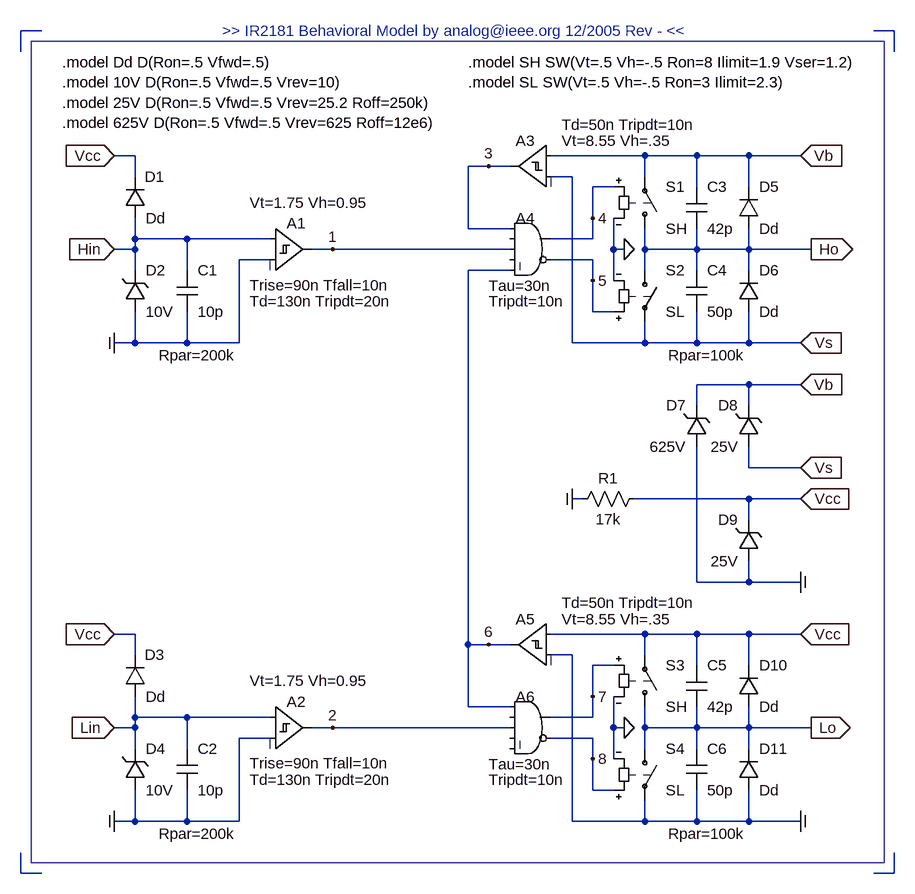
[diagram p0: schematic IR2181.asc]
IR2181.asc, the LTspice schematic file:
Version 4
SHEET 1 13828 1048
WIRE -496 -592 -496 -624
WIRE -496 672 -496 640
WIRE -464 -624 -496 -624
WIRE -464 672 -496 672
WIRE -320 -432 -352 -432
WIRE -320 -400 -320 -432
WIRE -320 -304 -320 -336
WIRE -320 -288 -352 -288
WIRE -320 -288 -320 -304
WIRE -320 -256 -320 -288
WIRE -320 -144 -352 -144
WIRE -320 -144 -320 -192
WIRE -320 304 -352 304
WIRE -320 336 -320 304
WIRE -320 432 -320 400
WIRE -320 448 -352 448
WIRE -320 448 -320 432
WIRE -320 480 -320 448
WIRE -320 592 -352 592
WIRE -320 592 -320 544
WIRE -240 -304 -320 -304
WIRE -240 -256 -240 -304
WIRE -240 -144 -320 -144
WIRE -240 -144 -240 -192
WIRE -240 432 -320 432
WIRE -240 480 -240 432
WIRE -240 592 -320 592
WIRE -240 592 -240 544
WIRE -160 -144 -240 -144
WIRE -160 -144 -160 -272
WIRE -160 592 -240 592
WIRE -160 592 -160 464
WIRE -112 -304 -240 -304
WIRE -112 -272 -160 -272
WIRE -112 432 -240 432
WIRE -112 464 -160 464
WIRE -16 -288 -48 -288
WIRE -16 448 -48 448
WIRE 192 -320 192 -416
WIRE 192 320 192 -256
WIRE 192 416 192 320
WIRE 224 -416 192 -416
WIRE 224 320 192 320
WIRE 256 -416 224 -416
WIRE 256 -320 192 -320
WIRE 256 -288 -16 -288
WIRE 256 -256 192 -256
WIRE 256 320 224 320
WIRE 256 416 192 416
WIRE 256 448 -16 448
WIRE 352 -400 320 -400
WIRE 352 -144 352 -400
WIRE 352 336 320 336
WIRE 352 592 352 336
WIRE 368 96 352 96
WIRE 384 -336 384 -384
WIRE 384 -304 320 -304
WIRE 384 -304 384 -336
WIRE 384 -272 320 -272
WIRE 384 -240 384 -272
WIRE 384 -192 384 -240
WIRE 384 400 384 352
WIRE 384 432 320 432
WIRE 384 432 384 400
WIRE 384 464 320 464
WIRE 384 496 384 464
WIRE 384 544 384 496
WIRE 416 -384 384 -384
WIRE 416 -288 416 -336
WIRE 416 -240 416 -288
WIRE 416 -192 384 -192
WIRE 416 352 384 352
WIRE 416 448 416 400
WIRE 416 496 416 448
WIRE 416 544 384 544
WIRE 432 -288 416 -288
WIRE 432 448 416 448
WIRE 464 -432 320 -432
WIRE 464 -400 464 -432
WIRE 464 -288 464 -320
WIRE 464 -256 464 -288
WIRE 464 -144 352 -144
WIRE 464 -144 464 -176
WIRE 464 304 320 304
WIRE 464 336 464 304
WIRE 464 448 464 416
WIRE 464 480 464 448
WIRE 464 592 352 592
WIRE 464 592 464 560
WIRE 544 -432 464 -432
WIRE 544 -384 544 -432
WIRE 544 -288 464 -288
WIRE 544 -288 544 -320
WIRE 544 -256 544 -288
WIRE 544 -144 464 -144
WIRE 544 -144 544 -192
WIRE 544 -48 544 -80
WIRE 544 224 544 16
WIRE 544 304 464 304
WIRE 544 352 544 304
WIRE 544 448 464 448
WIRE 544 448 544 416
WIRE 544 480 544 448
WIRE 544 592 464 592
WIRE 544 592 544 544
WIRE 624 -432 544 -432
WIRE 624 -384 624 -432
WIRE 624 -288 544 -288
WIRE 624 -288 624 -320
WIRE 624 -256 624 -288
WIRE 624 -144 544 -144
WIRE 624 -144 624 -192
WIRE 624 -80 544 -80
WIRE 624 -48 624 -80
WIRE 624 48 624 16
WIRE 624 96 448 96
WIRE 624 128 624 96
WIRE 624 224 544 224
WIRE 624 224 624 192
WIRE 624 304 544 304
WIRE 624 352 624 304
WIRE 624 448 544 448
WIRE 624 448 624 416
WIRE 624 480 624 448
WIRE 624 592 544 592
WIRE 624 592 624 544
WIRE 704 -432 624 -432
WIRE 704 -144 624 -144
WIRE 704 -80 624 -80
WIRE 704 48 624 48
WIRE 704 96 624 96
WIRE 704 224 624 224
WIRE 704 304 624 304
WIRE 704 592 624 592
WIRE 720 -288 624 -288
WIRE 720 448 624 448
WIRE 848 -624 816 -624
WIRE 848 -592 848 -624
WIRE 848 672 816 672
WIRE 848 672 848 640
FLAG 720 -288 Ho
IOPIN 720 -288 Out
FLAG -352 -288 Hin
IOPIN -352 -288 In
FLAG 704 -432 Vb
IOPIN 704 -432 In
FLAG 704 -144 Vs
IOPIN 704 -144 In
FLAG 704 224 Com
IOPIN 704 224 In
FLAG 704 304 Vcc
IOPIN 704 304 In
FLAG 704 592 Com
IOPIN 704 592 In
FLAG 720 448 Lo
IOPIN 720 448 Out
FLAG 432 -288 0
FLAG 224 320 6
FLAG 384 400 7
FLAG 384 496 8
FLAG -352 448 Lin
IOPIN -352 448 In
FLAG 704 96 Vcc
IOPIN 704 96 In
FLAG 704 -80 Vb
IOPIN 704 -80 In
FLAG 704 48 Vs
IOPIN 704 48 In
FLAG -16 448 2
FLAG 384 -336 4
FLAG 384 -240 5
FLAG -352 -432 Vcc
IOPIN -352 -432 In
FLAG -352 304 Vcc
IOPIN -352 304 In
FLAG -16 -288 1
FLAG 224 -416 3
FLAG -352 592 Com
IOPIN -352 592 In
FLAG -352 -144 Com
IOPIN -352 -144 In
FLAG 352 96 Com
IOPIN 352 96 In
FLAG 432 448 0
SYMBOL diode -336 -336 M180
WINDOW 0 31 64 Left 0
WINDOW 3 32 0 Left 0
SYMATTR InstName D1
SYMATTR Value Dd
SYMBOL zener -336 -192 M180
WINDOW 0 32 64 Left 0
WINDOW 3 32 0 Left 0
SYMATTR InstName D2
SYMATTR Value 10V
SYMBOL cap -256 -256 R0
WINDOW 0 32 0 Left 0
WINDOW 3 32 64 Left 0
WINDOW 39 32 131 Center 0
SYMATTR InstName C1
SYMATTR Value 10p
SYMATTR SpiceLine Rpar=200k
SYMBOL Digital\\diffschmtbuf -112 -352 R0
WINDOW 0 40 24 Center 0
WINDOW 3 -32 -8 Left 0
WINDOW 123 -32 119 Left 0
WINDOW 39 -32 144 Left 0
SYMATTR InstName A1
SYMATTR Value Vt=1.75 Vh=0.95
SYMATTR Value2 Trise=90n Tfall=10n
SYMATTR SpiceLine Td=130n Tripdt=20n
SYMBOL diode -336 400 M180
WINDOW 0 31 64 Left 0
WINDOW 3 32 0 Left 0
SYMATTR InstName D3
SYMATTR Value Dd
SYMBOL zener -336 544 M180
WINDOW 0 32 64 Left 0
WINDOW 3 32 0 Left 0
SYMATTR InstName D4
SYMATTR Value 10V
SYMBOL cap -256 480 R0
WINDOW 0 32 0 Left 0
WINDOW 3 32 64 Left 0
WINDOW 39 32 131 Center 0
SYMATTR InstName C2
SYMATTR Value 10p
SYMATTR SpiceLine Rpar=200k
SYMBOL Digital\\diffschmtbuf -112 384 R0
WINDOW 0 40 24 Center 0
WINDOW 3 -32 -8 Left 0
WINDOW 123 -32 119 Left 0
WINDOW 39 -32 144 Left 0
SYMATTR InstName A2
SYMATTR Value Vt=1.75 Vh=0.95
SYMATTR Value2 Trise=90n Tfall=10n
SYMATTR SpiceLine Td=130n Tripdt=20n
SYMBOL Digital\\diffschmtbuf 320 -480 M0
WINDOW 0 40 25 Center 0
WINDOW 3 -16 25 Right 0
WINDOW 123 -16 0 Right 0
SYMATTR InstName A3
SYMATTR Value Vt=8.55 Vh=.35
SYMATTR Value2 Td=50n Tripdt=10n
SYMBOL Digital\\and 288 -352 R0
WINDOW 0 -8 16 Center 0
WINDOW 3 -64 120 Left 0
WINDOW 123 -64 144 Left 0
SYMATTR InstName A4
SYMATTR Value Tau=30n
SYMATTR Value2 Tripdt=10n
SYMBOL sw 464 -304 M180
WINDOW 0 32 80 Left 0
WINDOW 3 32 16 Left 0
SYMATTR InstName S1
SYMATTR Value SH
SYMBOL sw 464 -272 R0
WINDOW 0 32 16 Left 0
WINDOW 3 32 80 Left 0
SYMATTR InstName S2
SYMATTR Value SL
SYMBOL cap 528 -384 R0
WINDOW 0 32 0 Left 0
WINDOW 3 32 64 Left 0
SYMATTR InstName C3
SYMATTR Value 42p
SYMBOL cap 528 -256 R0
WINDOW 0 32 0 Left 0
WINDOW 3 32 64 Left 0
WINDOW 39 32 131 Center 0
SYMATTR InstName C4
SYMATTR Value 50p
SYMATTR SpiceLine Rpar=100k
SYMBOL diode 608 -320 M180
WINDOW 0 32 64 Left 0
WINDOW 3 32 0 Left 0
SYMATTR InstName D5
SYMATTR Value Dd
SYMBOL diode 608 -192 M180
WINDOW 0 32 64 Left 0
WINDOW 3 32 0 Left 0
SYMATTR InstName D6
SYMATTR Value Dd
SYMBOL zener 528 16 M180
WINDOW 0 0 64 Right 0
WINDOW 3 0 0 Right 0
SYMATTR InstName D7
SYMATTR Value 625V
SYMBOL zener 608 16 M180
WINDOW 0 0 64 Right 0
WINDOW 3 0 0 Right 0
SYMATTR InstName D8
SYMATTR Value 25V
SYMBOL zener 608 192 M180
WINDOW 0 0 64 Right 0
WINDOW 3 0 0 Right 0
SYMATTR InstName D9
SYMATTR Value 25V
SYMBOL res 464 80 R90
WINDOW 0 0 56 VBottom 0
WINDOW 3 32 56 VTop 0
SYMATTR InstName R1
SYMATTR Value 17k
SYMBOL Digital\\diffschmtbuf 320 256 M0
WINDOW 0 40 25 Center 0
WINDOW 3 -16 25 Right 0
WINDOW 123 -16 0 Right 0
SYMATTR InstName A5
SYMATTR Value Vt=8.55 Vh=.35
SYMATTR Value2 Td=50n Tripdt=10n
SYMBOL Digital\\and 288 384 R0
WINDOW 0 -8 16 Center 0
WINDOW 3 -64 120 Left 0
WINDOW 123 -64 144 Left 0
SYMATTR InstName A6
SYMATTR Value Tau=30n
SYMATTR Value2 Tripdt=10n
SYMBOL sw 464 432 M180
WINDOW 0 32 80 Left 0
WINDOW 3 32 16 Left 0
SYMATTR InstName S3
SYMATTR Value SH
SYMBOL sw 464 464 R0
WINDOW 0 32 16 Left 0
WINDOW 3 32 80 Left 0
SYMATTR InstName S4
SYMATTR Value SL
SYMBOL cap 528 352 R0
WINDOW 0 32 0 Left 0
WINDOW 3 32 64 Left 0
SYMATTR InstName C5
SYMATTR Value 42p
SYMBOL cap 528 480 R0
WINDOW 0 32 0 Left 0
WINDOW 3 32 64 Left 0
WINDOW 39 32 131 Center 0
SYMATTR InstName C6
SYMATTR Value 50p
SYMATTR SpiceLine Rpar=100k
SYMBOL diode 608 416 M180
WINDOW 0 32 64 Left 0
WINDOW 3 32 0 Left 0
SYMATTR InstName D10
SYMATTR Value Dd
SYMBOL diode 608 544 M180
WINDOW 0 32 64 Left 0
WINDOW 3 32 0 Left 0
SYMATTR InstName D11
SYMATTR Value Dd
TEXT 176 -624 Center 0 ;>> IR2181 Behavioral Model by analog@ieee.org 12/2005 Rev - <<
TEXT -432 -576 Left 0 !.model Dd D(Ron=.5 Vfwd=.5)\n.model 10V D(Ron=.5 Vfwd=.5 Vrev=10)\n.model 25V D(Ron=.5 Vfwd=.5 Vrev=25.2 Roff=250k)\n.model 625V D(Ron=.5 Vfwd=.5 Vrev=625 Roff=12e6)
TEXT 192 -576 Left 0 !.model SH SW(Vt=.5 Vh=-.5 Ron=8 Ilimit=1.9 Vser=1.2)\n.model SL SW(Vt=.5 Vh=-.5 Ron=3 Ilimit=2.3)
RECTANGLE Normal 832 656 -480 -608

The netlist it stands for:
* IR2181.asc
D1 Hin Vcc Dd
D2 Com Hin 10V
C1 Hin Com 10p Rpar=200k
A1 Hin Com 0 0 0 0 1 0 SCHMITT Vt=1.75 Vh=0.95 Trise=90n Tfall=10n Td=130n Tripdt=20n
D3 Lin Vcc Dd
D4 Com Lin 10V
C2 Lin Com 10p Rpar=200k
A2 Lin Com 0 0 0 0 2 0 SCHMITT Vt=1.75 Vh=0.95 Trise=90n Tfall=10n Td=130n Tripdt=20n
A3 Vb Vs 0 0 0 0 3 0 SCHMITT Vt=8.55 Vh=.35 Td=50n Tripdt=10n
A4 3 0 1 0 6 5 4 0 AND Tau=30n Tripdt=10n
S1 Ho Vb 4 0 SH
S2 Ho Vs 5 0 SL
C3 Vb Ho 42p
C4 Ho Vs 50p Rpar=100k
D5 Ho Vb Dd
D6 Vs Ho Dd
D7 Com Vb 625V
D8 Vs Vb 25V
D9 Com Vcc 25V
R1 Vcc Com 17k
A5 Vcc Com 0 0 0 0 6 0 SCHMITT Vt=8.55 Vh=.35 Td=50n Tripdt=10n
A6 6 0 2 0 0 8 7 0 AND Tau=30n Tripdt=10n
S3 Lo Vcc 7 0 SH
S4 Lo Com 8 0 SL
C5 Vcc Lo 42p
C6 Lo Com 50p Rpar=100k
D10 Lo Vcc Dd
D11 Com Lo Dd
.model D D
.lib standard.dio
* >> IR2181 Behavioral Model by analog@ieee.org 12/2005 Rev - <<
.model Dd D(Ron=.5 Vfwd=.5)
.model 10V D(Ron=.5 Vfwd=.5 Vrev=10)
.model 25V D(Ron=.5 Vfwd=.5 Vrev=25.2 Roff=250k)
.model 625V D(Ron=.5 Vfwd=.5 Vrev=625 Roff=12e6)
.model SH SW(Vt=.5 Vh=-.5 Ron=8 Ilimit=1.9 Vser=1.2)
.model SL SW(Vt=.5 Vh=-.5 Ron=3 Ilimit=2.3)
.backanno
.end